# EAGLE schematic decade_pwm_rgb_led (EAGLE 6.4)
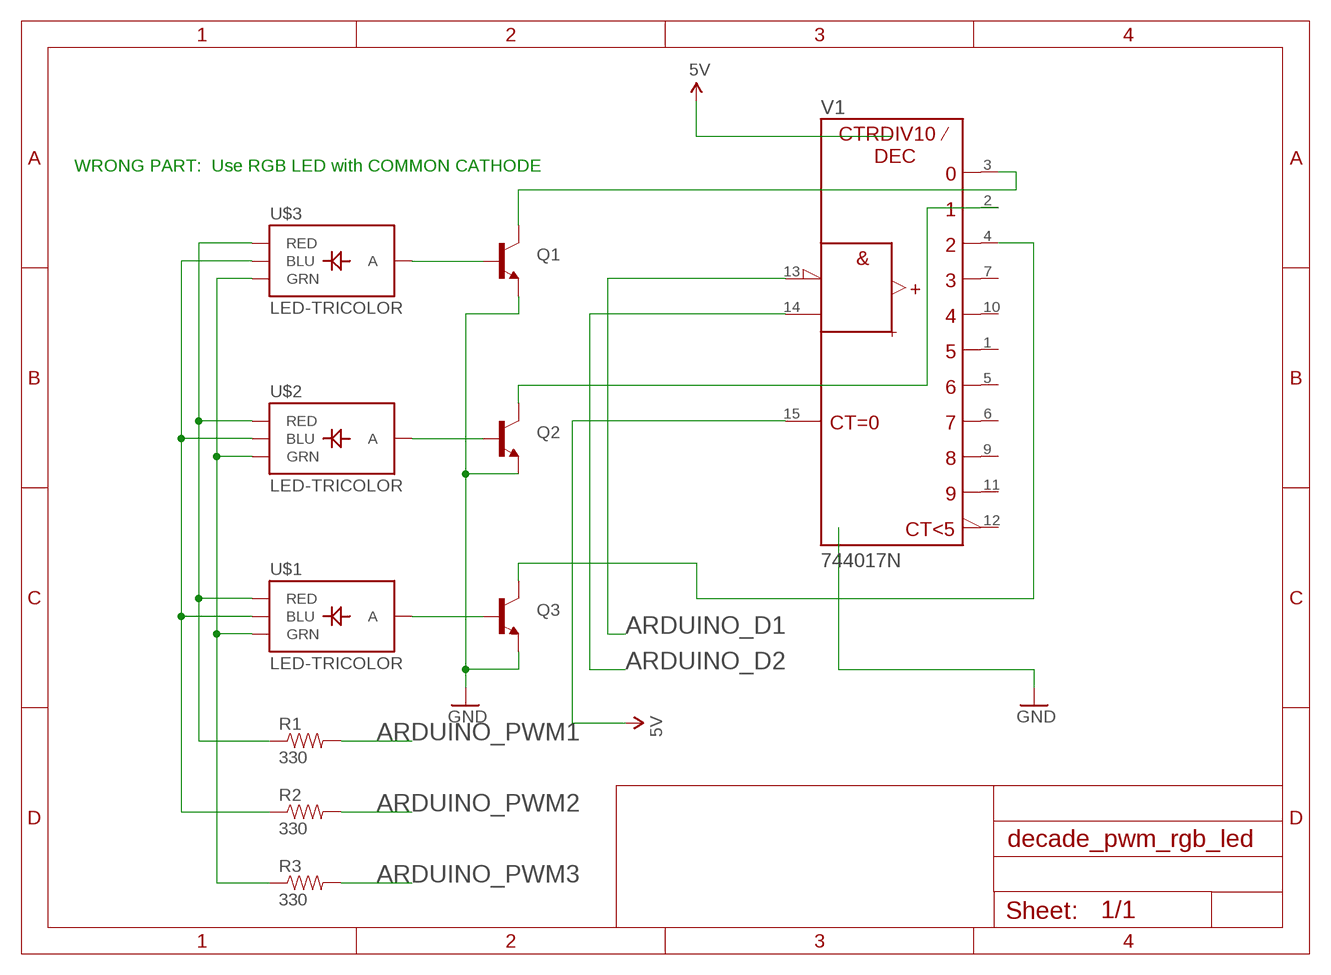
[diagram p0: schematic, sheet 1]

## Parts
Q1  TRANSISTOR_NPNTO-92-AMMO  [TO-92-AMMO]
Q2  TRANSISTOR_NPNTO-92-AMMO  [TO-92-AMMO]
Q3  TRANSISTOR_NPNTO-92-AMMO  [TO-92-AMMO]
R1  330  RESISTORPTH-1/4W  [AXIAL-0.4]
R2  330  RESISTORPTH-1/4W  [AXIAL-0.4]
R3  330  RESISTORPTH-1/4W  [AXIAL-0.4]
U$1  LED-TRICOLOR  [LED-TRICOLOR-SMD]
U$2  LED-TRICOLOR  [LED-TRICOLOR-SMD]
U$3  LED-TRICOLOR  [LED-TRICOLOR-SMD]
V1  744017N  [DIL16]

## Nets
5V: V1.15(CLR)
ARDUINO_D1: V1.13(!CLKEN)
ARDUINO_D2: V1.14(CLK)
ARDUINO_PWM1: R1.P$2
ARDUINO_PWM2: R2.P$2
ARDUINO_PWM3: R3.P$2
GND: Q1.1(E) Q2.1(E) Q3.1(E)
N$1: Q2.2(B) U$2.A
N$2: Q3.2(B) U$1.A
N$3: Q1.2(B) U$3.A
N$4: Q1.3(C) V1.3(Y0)
N$5: Q2.3(C) V1.2(Y1)
N$6: Q3.3(C) V1.4(Y2)
N$7: R1.P$1 U$1.R(RED) U$2.R(RED) U$3.R(RED)
N$8: R2.P$1 U$1.B(BLU) U$2.B(BLU) U$3.B(BLU)
N$9: R3.P$1 U$1.G(GRN) U$2.G(GRN) U$3.G(GRN)
Unconnected: V1.1(Y5) V1.5(Y6) V1.6(Y7) V1.7(Y3) V1.9(Y8) V1.10(Y4) V1.11(Y9) V1.12(CO)

## Notes on the sheet
- WRONG PART:  Use RGB LED with COMMON CATHODE

## Power pins joined to a net without a drawn wire
+UB: V1.16(+UB)
-UB: V1.8(-UB)

## Library data of the parts
Q1-Q3 = SparkFun:TRANSISTOR_NPN: Transistor NPN BJT configuration in SOT23 package. MMBT2222 is the common NPN we use. Double check BCE configuration again layout.
R1-R3 = SparkFun:RESISTOR: Resistor Basic schematic elements and footprints for 0603, 1206, and PTH resistors.
U$1-U$3 = SparkFun:LED-TRICOLOR: Tri-Color LED SMD Proven layout and schematic for triple color LED in SMD package - common anode. Spark Fun Electronics SKU : COM-07844
V1 = 74ttl-din:74*4017: 4-bit asynchronous decade COUNTER